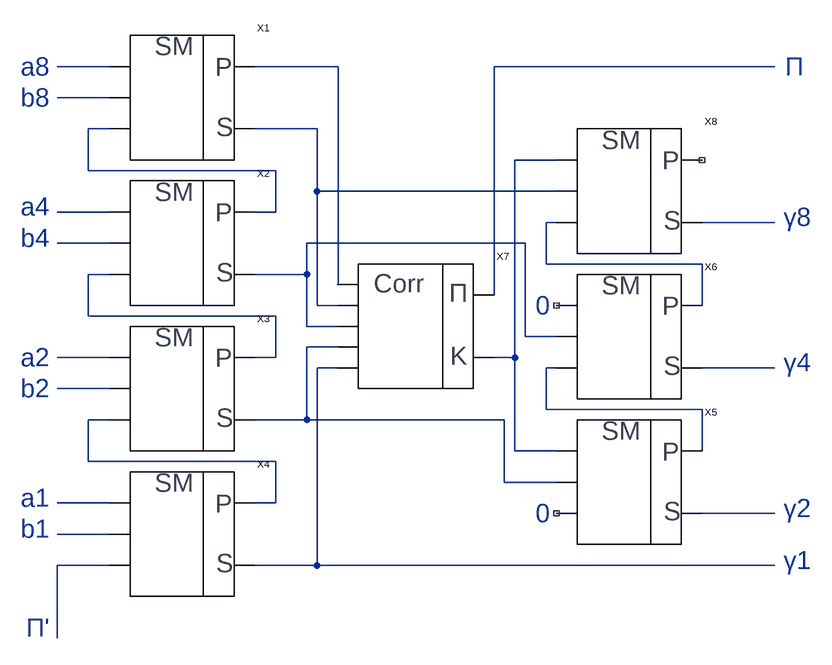
[diagram p0: schematic DC.asc]
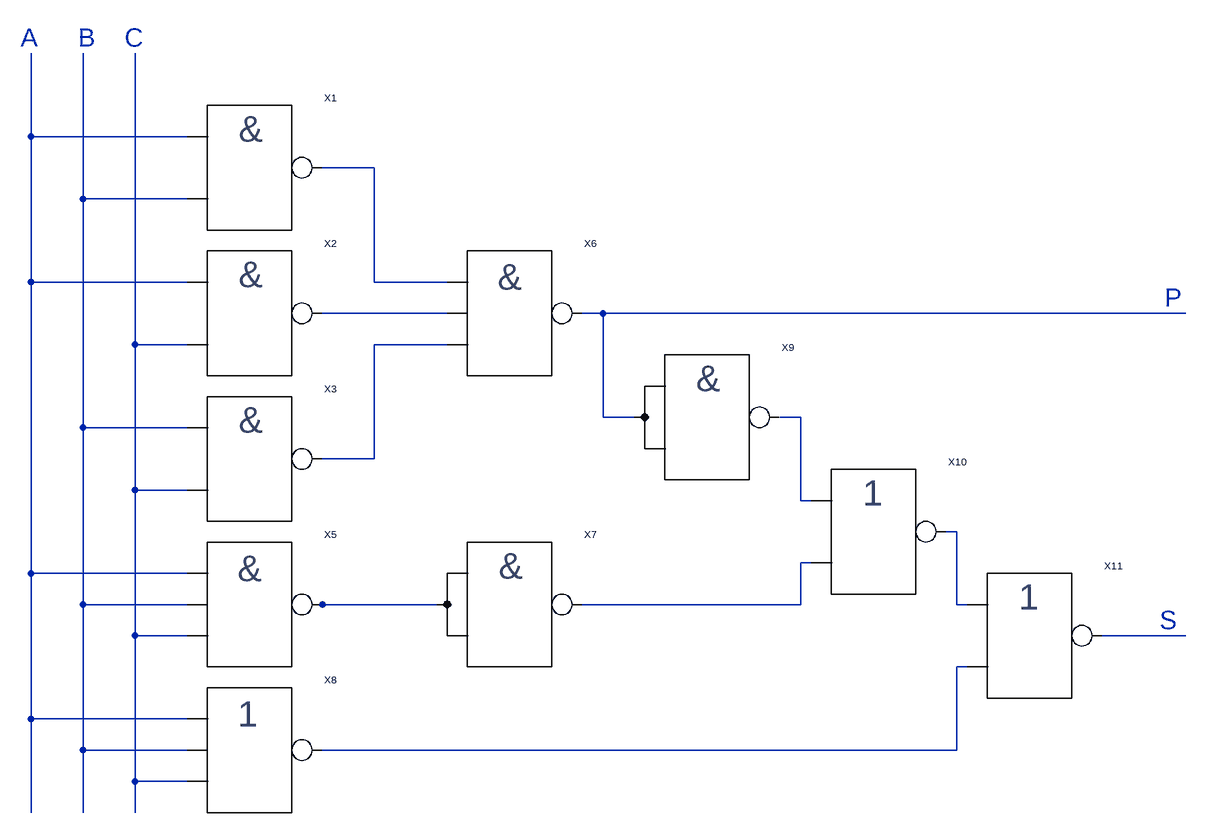
[diagram p1: sub-circuit sm.asc]
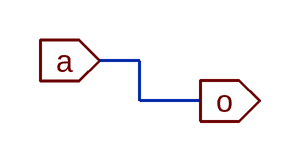
[diagram p2: sub-circuit nand1.asc]
DC.asc, the LTspice schematic file:
Version 4
SHEET 1 1172 972
WIRE -48 80 -128 80
WIRE 304 80 176 80
WIRE 976 80 544 80
WIRE -48 128 -128 128
WIRE -48 176 -80 176
WIRE 272 176 176 176
WIRE 640 224 576 224
WIRE -80 240 -80 176
WIRE 208 240 -80 240
WIRE 272 272 272 176
WIRE 640 272 272 272
WIRE -48 304 -128 304
WIRE 208 304 208 240
WIRE 208 304 176 304
WIRE 640 320 624 320
WIRE 976 320 864 320
WIRE -48 352 -128 352
WIRE 592 352 256 352
WIRE 624 384 624 320
WIRE 864 384 624 384
WIRE -48 400 -80 400
WIRE 256 400 256 352
WIRE 256 400 176 400
WIRE 304 416 304 80
WIRE 544 432 544 80
WIRE 272 448 272 272
WIRE 304 448 272 448
WIRE 864 448 864 384
WIRE -80 464 -80 400
WIRE 208 464 -80 464
WIRE 256 480 256 400
WIRE 304 480 256 480
WIRE 592 496 592 352
WIRE 640 496 592 496
WIRE 304 512 256 512
WIRE -48 528 -128 528
WIRE 208 528 208 464
WIRE 208 528 176 528
WIRE 576 528 576 224
WIRE 576 528 544 528
WIRE 304 544 272 544
WIRE 640 544 624 544
WIRE 976 544 864 544
WIRE -48 576 -128 576
WIRE 624 608 624 544
WIRE 864 608 624 608
WIRE -48 624 -80 624
WIRE 256 624 256 512
WIRE 256 624 176 624
WIRE 560 624 256 624
WIRE 576 672 576 528
WIRE 640 672 576 672
WIRE 864 672 864 608
WIRE -80 688 -80 624
WIRE 208 688 -80 688
WIRE 560 720 560 624
WIRE 640 720 560 720
WIRE -48 752 -128 752
WIRE 208 752 208 688
WIRE 208 752 176 752
WIRE 976 768 864 768
WIRE -48 800 -128 800
WIRE -48 848 -128 848
WIRE 272 848 272 544
WIRE 272 848 176 848
WIRE 976 848 272 848
WIRE -128 960 -128 848
SYMBOL SM 48 128 R0
SYMATTR InstName X1
SYMBOL SM 48 352 R0
SYMATTR InstName X2
SYMBOL SM 48 576 R0
SYMATTR InstName X3
SYMBOL SM 48 800 R0
SYMATTR InstName X4
SYMBOL Corr 400 480 R0
SYMATTR InstName X7
SYMBOL SM 736 720 R0
SYMATTR InstName X5
SYMBOL SM 736 496 R0
SYMATTR InstName X6
SYMBOL SM 736 272 R0
SYMATTR InstName X8
TEXT 992 80 Left 4 ;П
TEXT 1032 312 Right 4 ;γ8
TEXT 1032 536 Right 4 ;γ4
TEXT 1032 760 Right 4 ;γ2
TEXT 1032 840 Right 4 ;γ1
TEXT -184 80 Left 4 ;a8
TEXT -184 128 Left 4 ;b8
TEXT -184 296 Left 4 ;a4
TEXT -184 344 Left 4 ;b4
TEXT -184 528 Left 4 ;a2
TEXT -184 576 Left 4 ;b2
TEXT -184 744 Left 4 ;a1
TEXT -184 792 Left 4 ;b1
TEXT -176 944 Left 4 ;П'
TEXT 608 448 Left 4 ;0
TEXT 608 768 Left 4 ;0

sm.asc, the sub-circuit schematic file:
Version 4
SHEET 1 1572 1124
WIRE -208 80 -208 -48
WIRE 32 80 -208 80
WIRE 320 128 240 128
WIRE -128 176 -128 -48
WIRE 32 176 -128 176
WIRE -208 304 -208 80
WIRE 32 304 -208 304
WIRE 320 304 320 128
WIRE 432 304 320 304
WIRE 432 352 240 352
WIRE 672 352 640 352
WIRE 1568 352 672 352
WIRE -48 400 -48 -48
WIRE 32 400 -48 400
WIRE 432 400 320 400
WIRE 672 512 672 352
WIRE 720 512 672 512
WIRE 976 512 944 512
WIRE -128 528 -128 176
WIRE 32 528 -128 528
WIRE 320 576 320 400
WIRE 320 576 240 576
WIRE -48 624 -48 400
WIRE 32 624 -48 624
WIRE 976 640 976 512
WIRE 992 640 976 640
WIRE 1216 688 1200 688
WIRE 992 736 976 736
WIRE -208 752 -208 304
WIRE 32 752 -208 752
WIRE -128 800 -128 528
WIRE 32 800 -128 800
WIRE 240 800 224 800
WIRE 416 800 240 800
WIRE 976 800 976 736
WIRE 976 800 640 800
WIRE 1216 800 1216 688
WIRE 1232 800 1216 800
WIRE -48 848 -48 624
WIRE 32 848 -48 848
WIRE 1568 848 1440 848
WIRE 1232 896 1216 896
WIRE -208 976 -208 752
WIRE 32 976 -208 976
WIRE -128 1024 -128 800
WIRE 32 1024 -128 1024
WIRE 1216 1024 1216 896
WIRE 1216 1024 240 1024
WIRE -48 1072 -48 848
WIRE 32 1072 -48 1072
WIRE -208 1120 -208 976
WIRE -128 1120 -128 1024
WIRE -48 1120 -48 1072
SYMBOL NAND2 128 128 R0
SYMATTR InstName X1
SYMBOL NAND2 128 352 R0
SYMATTR InstName X2
SYMBOL NAND2 128 576 R0
SYMATTR InstName X3
SYMBOL NAND3 128 800 R0
SYMATTR InstName X5
SYMBOL NAND3 528 352 R0
SYMATTR InstName X6
SYMBOL NAND1 528 800 R0
SYMATTR InstName X7
SYMBOL NOR3 128 1024 R0
SYMATTR InstName X8
SYMBOL NAND1 832 512 R0
SYMATTR InstName X9
SYMBOL NOR2 1088 688 R0
SYMATTR InstName X10
SYMBOL NOR2 1328 848 R0
SYMATTR InstName X11
TEXT 1536 328 Left 4 ;P
TEXT 1528 824 Left 4 ;S
TEXT -224 -72 Left 4 ;A
TEXT -136 -72 Left 4 ;B
TEXT -64 -72 Left 4 ;C

nand1.asc, the sub-circuit schematic file:
Version 4
SHEET 1 880 680
WIRE 96 80 64 80
WIRE 96 112 96 80
WIRE 144 112 96 112
FLAG 64 80 a
IOPIN 64 80 In
FLAG 144 112 o
IOPIN 144 112 Out

The netlist it stands for:
* DC.asc
XX1 N001 N004 N005 N002 N006 sm
XX2 N008 N011 N013 N005 N012 sm
XX3 N015 N019 N020 N013 N014 sm
XX4 N021 N023 N024 N020 N016 sm
XX7 N002 N006 N012 N014 N016 N003 N007 Corr  ; pins q1 q2 q3 q4 p k1 k2
XX5 N007 N014 NC_01 N017 N022 sm
XX6 NC_02 N012 N017 N009 N018 sm
XX8 N007 N006 N009 NC_03 N010 sm

* block symbol definitions
.subckt sm a b c S M
XX1 N001 N003 N002 NAND2  ; pins a b o
XX2 N001 N006 N004 NAND2  ; pins a b o
XX3 N003 N006 N007 NAND2  ; pins a b o
XX5 N001 N006 N011 N003 NAND3  ; pins a b o c
XX6 N002 N007 N005 N004 NAND3  ; pins a b o c
XX7 N011 N010 nand1
XX8 N001 N006 N013 N003 NOR3  ; pins a b o c
XX9 N005 N008 nand1
XX10 N008 N010 N009 NOR2  ; pins a b o
XX11 N009 N013 N012 NOR2  ; pins a b o
* P
* S
* A
* B
* C
.ends sm

.subckt nand1 a o
.ends nand1

* П
* γ8
* γ4
* γ2
* γ1
* a8
* b8
* a4
* b4
* a2
* b2
* a1
* b1
* П'
* 0
* 0
.backanno
.end